# EAGLE design microsd-switch (EAGLE 8.2.0)
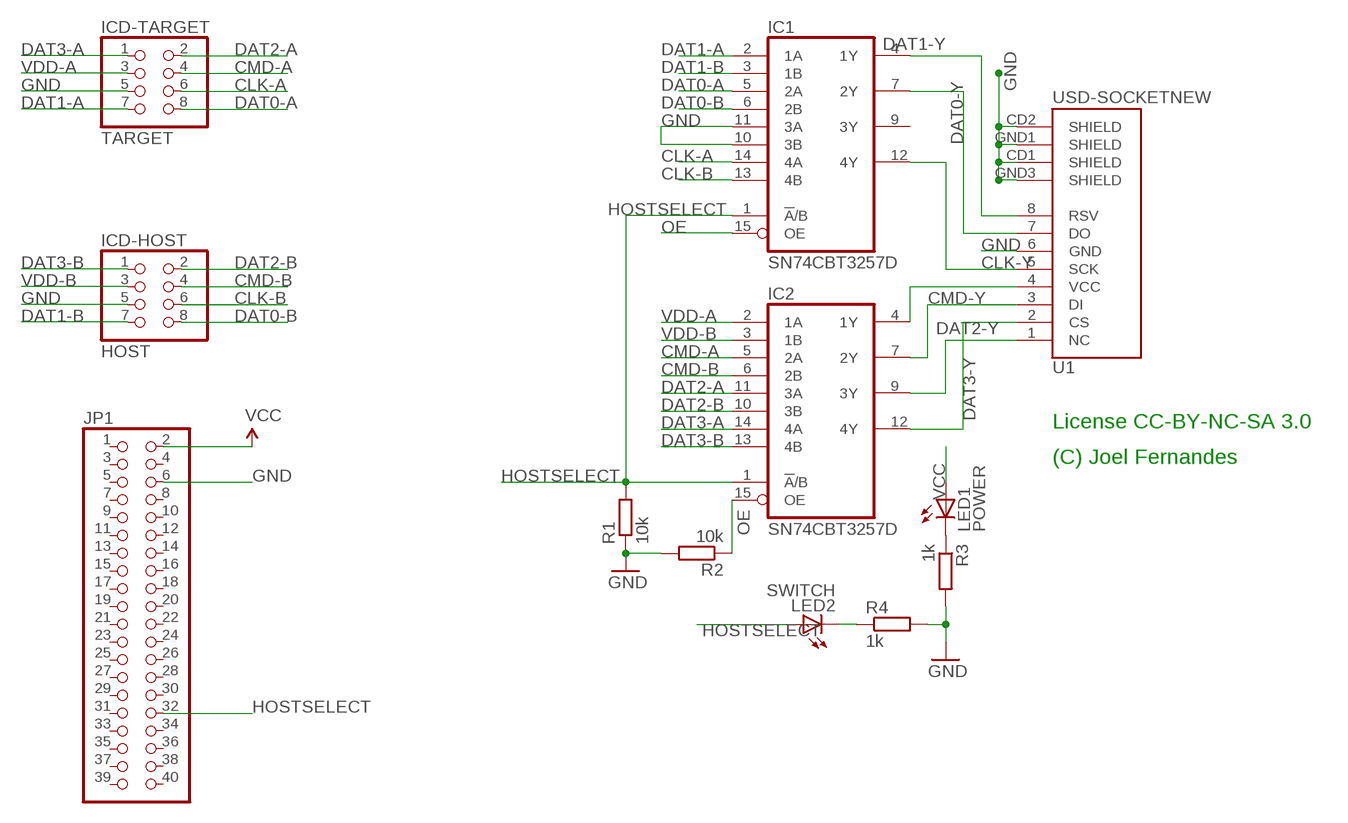
[diagram p0: schematic, sheet 1]

## Parts
IC1  SN74CBT3257D  [SO16]
IC2  SN74CBT3257D  [SO16]
ICD-HOST  HOST  PINHD-2X4  [2X04]
ICD-TARGET  TARGET  PINHD-2X4  [2X04]
JP1  PINHD-2X20  [2X20]
LED1  POWER  LEDCHIP-LED0805  [CHIP-LED0805]
LED2  SWITCH  LEDCHIP-LED0805  [CHIP-LED0805]
R1  10k  R-EU_R1206  [R1206]
R2  10k  R-EU_R1206  [R1206]
R3  1k  R-EU_R1206  [R1206]
R4  1k  R-EU_R1206  [R1206]
U1  USD-SOCKETNEW  [MICRO-SD-SOCKET-PP]

## Nets
CLK-A: IC1.14(4A) ICD-TARGET.6
CLK-B: IC1.13(4B) ICD-HOST.6
CLK-Y: IC1.12(4Y) U1.5(SCK)
CMD-A: IC2.5(2A) ICD-TARGET.4
CMD-B: IC2.6(2B) ICD-HOST.4
CMD-Y: IC2.7(2Y) U1.3(DI)
DAT0-A: IC1.5(2A) ICD-TARGET.8
DAT0-B: IC1.6(2B) ICD-HOST.8
DAT0-Y: IC1.7(2Y) U1.7(DO)
DAT1-A: IC1.2(1A) ICD-TARGET.7
DAT1-B: IC1.3(1B) ICD-HOST.7
DAT1-Y: IC1.4(1Y) U1.8(RSV)
DAT2-A: IC2.11(3A) ICD-TARGET.2
DAT2-B: IC2.10(3B) ICD-HOST.2
DAT2-Y: IC2.9(3Y) U1.1(NC)
DAT3-A: IC2.14(4A) ICD-TARGET.1
DAT3-B: IC2.13(4B) ICD-HOST.1
DAT3-Y: IC2.12(4Y) U1.2(CS)
GND: IC1.10(3B) IC1.11(3A) ICD-HOST.5 ICD-TARGET.5 JP1.6 R1.1 R2.2 R3.2 R4.2 U1.6(GND) U1.CD1(SHIELD) U1.CD2(SHIELD) U1.GND1(SHIELD) U1.GND3(SHIELD)
HOSTSELECT: IC1.1(!A!/B) IC2.1(!A!/B) JP1.32 LED2.A R1.2
N$2: IC2.4(1Y) U1.4(VCC)
N$3: LED1.C R3.1
N$4: LED2.C R4.1
OE: IC1.15(OE) IC2.15(OE) R2.1
VCC: JP1.2 LED1.A
VDD-A: IC2.2(1A) ICD-TARGET.3
VDD-B: IC2.3(1B) ICD-HOST.3
Unconnected: IC1.9(3Y) JP1.1 JP1.3 JP1.4 JP1.5 JP1.7 JP1.8 JP1.9 JP1.10 JP1.11 JP1.12 JP1.13 JP1.14 JP1.15 JP1.16 JP1.17 JP1.18 JP1.19 JP1.20 JP1.21 JP1.22 JP1.23 JP1.24 JP1.25 JP1.26 JP1.27 JP1.28 JP1.29 JP1.30 JP1.31 JP1.33 JP1.34 JP1.35 JP1.36 JP1.37 JP1.38 JP1.39 JP1.40

## Notes on the sheet
- License CC-BY-NC-SA 3.0
- (C) Joel Fernandes

## Power pins joined to a net without a drawn wire
GND: IC1.8(GND) IC2.8(GND)
VCC: IC1.16(VCC) IC2.16(VCC)

## Library data of the parts
IC1 IC2 = joels-parts:SN74CBT3257: High speed Quad 1:2 MUX/DEMUX (4-5.5v vcc, 100mA channel)
ICD-HOST ICD-TARGET = pinhead:PINHD-2X4: PIN HEADER
JP1 = pinhead:PINHD-2X20: PIN HEADER
LED1 LED2 = led:LED: LED OSRAM: - CHIPLED LG R971, LG N971, LY N971, LG Q971, LY Q971, LO R971, LY R971 LH N974, LH R974 LS Q976, LO Q976, LY Q976 LO Q996 - Hyper CHIPLED LW Q18S LB Q993, LB Q99A, LB R99A - SideLED LS A670, LO A670, LY A670, LG A670, LP A670 LB A673, LV A673, LT A673, LW A673 LH A674 LY A675 LS A676, LA A676, LO A676, LY A676, LW A676 LS A679, LY A679, LG A679 - Hyper Micro SIDELED® LS Y876, LA Y876, LO Y876, LY Y876 LT Y87S - SmartLED LW L88C, LW L88S LB L89C, LB L89S, LG L890 LS L89K, LO L89K, LY L89K LS L896, LA L896, LO L896, LY L896 - TOPLED LS T670, LO T670, LY T670, LG T670, LP T670 LSG T670, LSP T670, LSY T670, LOP T670, LYG T670 LG T671, LOG T671, LSG T671 LB T673, LV T673, LT T673, LW T673 LH T674 LS T676, LA T676, LO T676, LY T676, LB T676, LH T676, LSB T676, LW T676 LB T67C, LV T67C, LT T67C, LS T67K, LO T67K, LY T67K, LW E67C LS E67B, LA E67B, LO E67B, LY E67B, LB E67C, LV E67C, LT E67C LW T67C LS T679, LY T679, LG T679 LS T770, LO T770, LY T770, LG T770, LP T770 LB T773, LV T773, LT T773, LW T773 LH T774 LS E675, LA E675, LY E675, LS T675 LS T776, LA T776, LO T776, LY T776, LB T776 LHGB T686 LT T68C, LB T68C - Hyper Mini TOPLED® LB M676 - Mini TOPLED Santana® LG M470 LS M47K, LO M47K, LY M47K Source: http://www.osram.convergy.de LUXEON: - LUMILED® LXK2-PW12-R00, LXK2-PW12-S00, LXK2-PW14-U00, LXK2-PW14-V00 LXK2-PM12-R00, LXK2-PM12-S00, LXK2-PM14-U00 LXK2-PE12-Q00, LXK2-PE12-R00, LXK2-PE12-S00, LXK2-PE14-T00, LXK2-PE14-U00 LXK2-PB12-K00, LXK2-PB12-L00, LXK2-PB12-M00, LXK2-PB14-N00, LXK2-PB14-P00, LXK2-PB14-Q00 LXK2-PR12-L00, LXK2-PR12-M00, LXK2-PR14-Q00, LXK2-PR14-R00 LXK2-PD12-Q00, LXK2-PD12-R00, LXK2-PD12-S00 LXK2-PH12-R00, LXK2-PH12-S00 LXK2-PL12-P00, LXK2-PL12-Q00, LXK2-PL12-R00 Source: www.luxeon.com KINGBRIGHT: KA-3528ASYC Source: www.kingbright.com
R1-R4 = rcl:R-EU_: RESISTOR, European symbol
U1 = SparkFun:USD-SOCKET: microSD Socket Push-push type uSD socket. Schematic element and footprint production proven. Spark Fun Electronics SKU : PRT-00127. tDoc lines correctly indicate media card edge positions when inserting (unlocked, locked, depressed).

## Net classes
0 default: width 0.406 mm, drill 0.254 mm, clearance 0.205 mm
1 power: width 0.406 mm, drill 0.254 mm, clearance 0.205 mm to class 0, clearance 0.205 mm

## Board
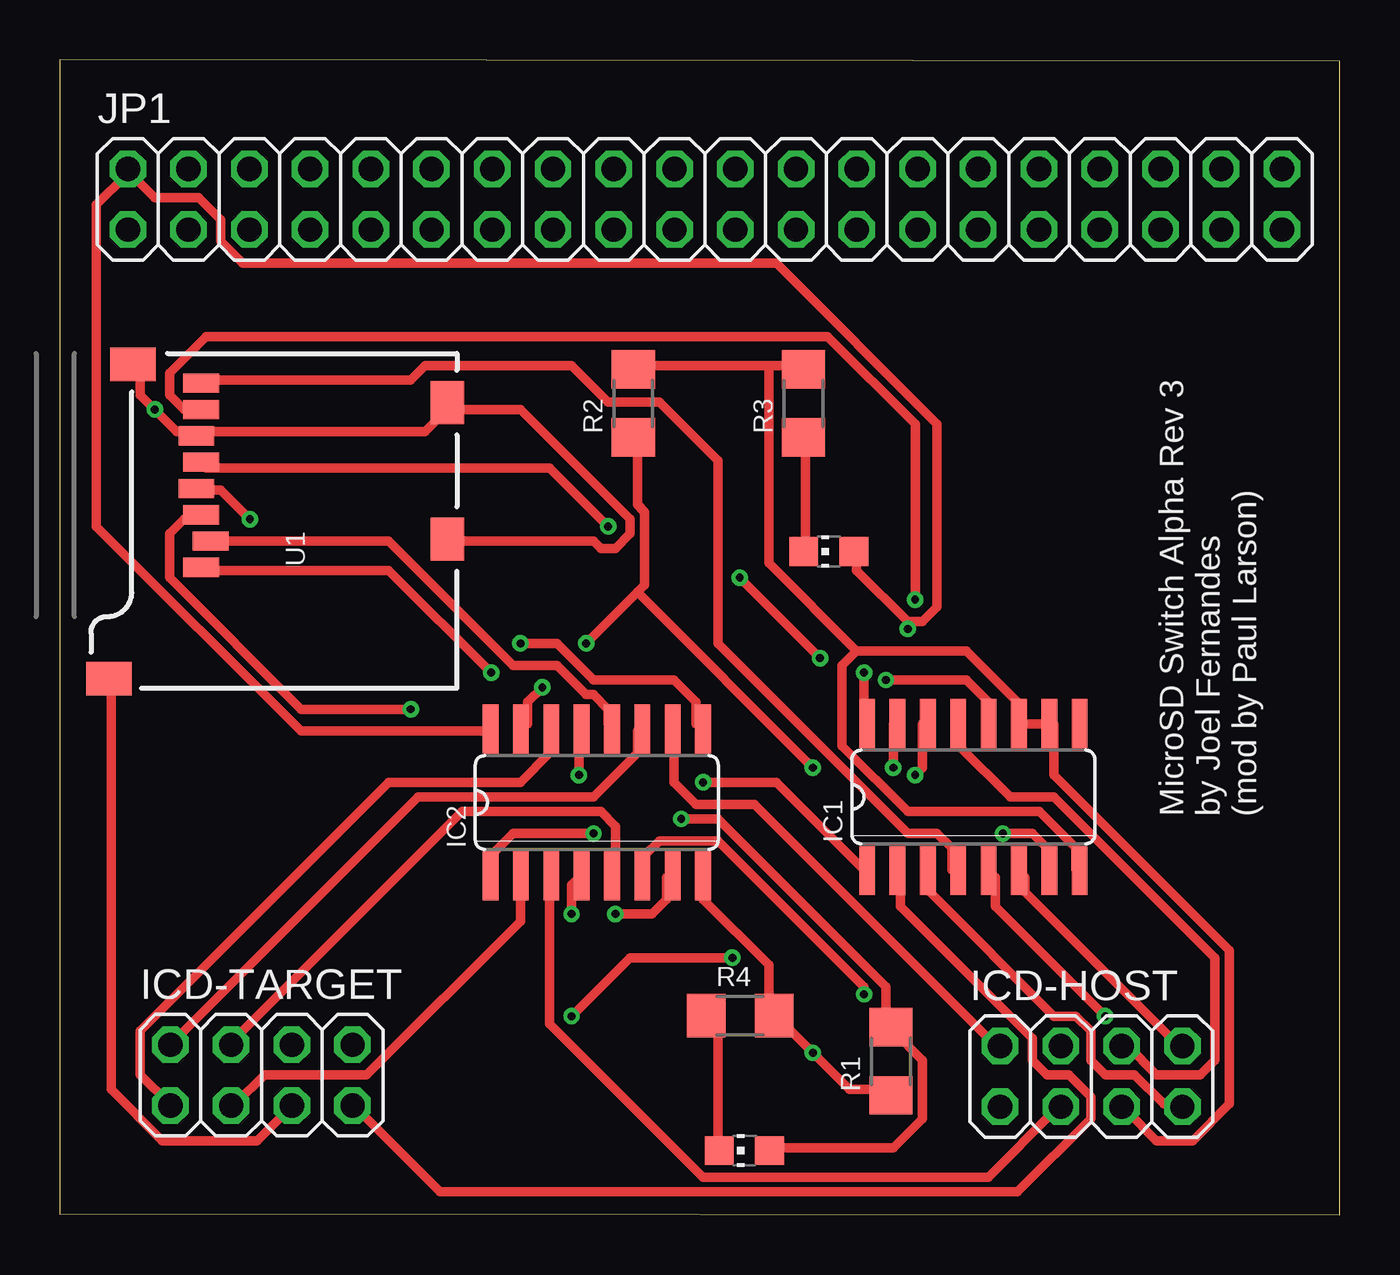
[diagram p1: board, top side]
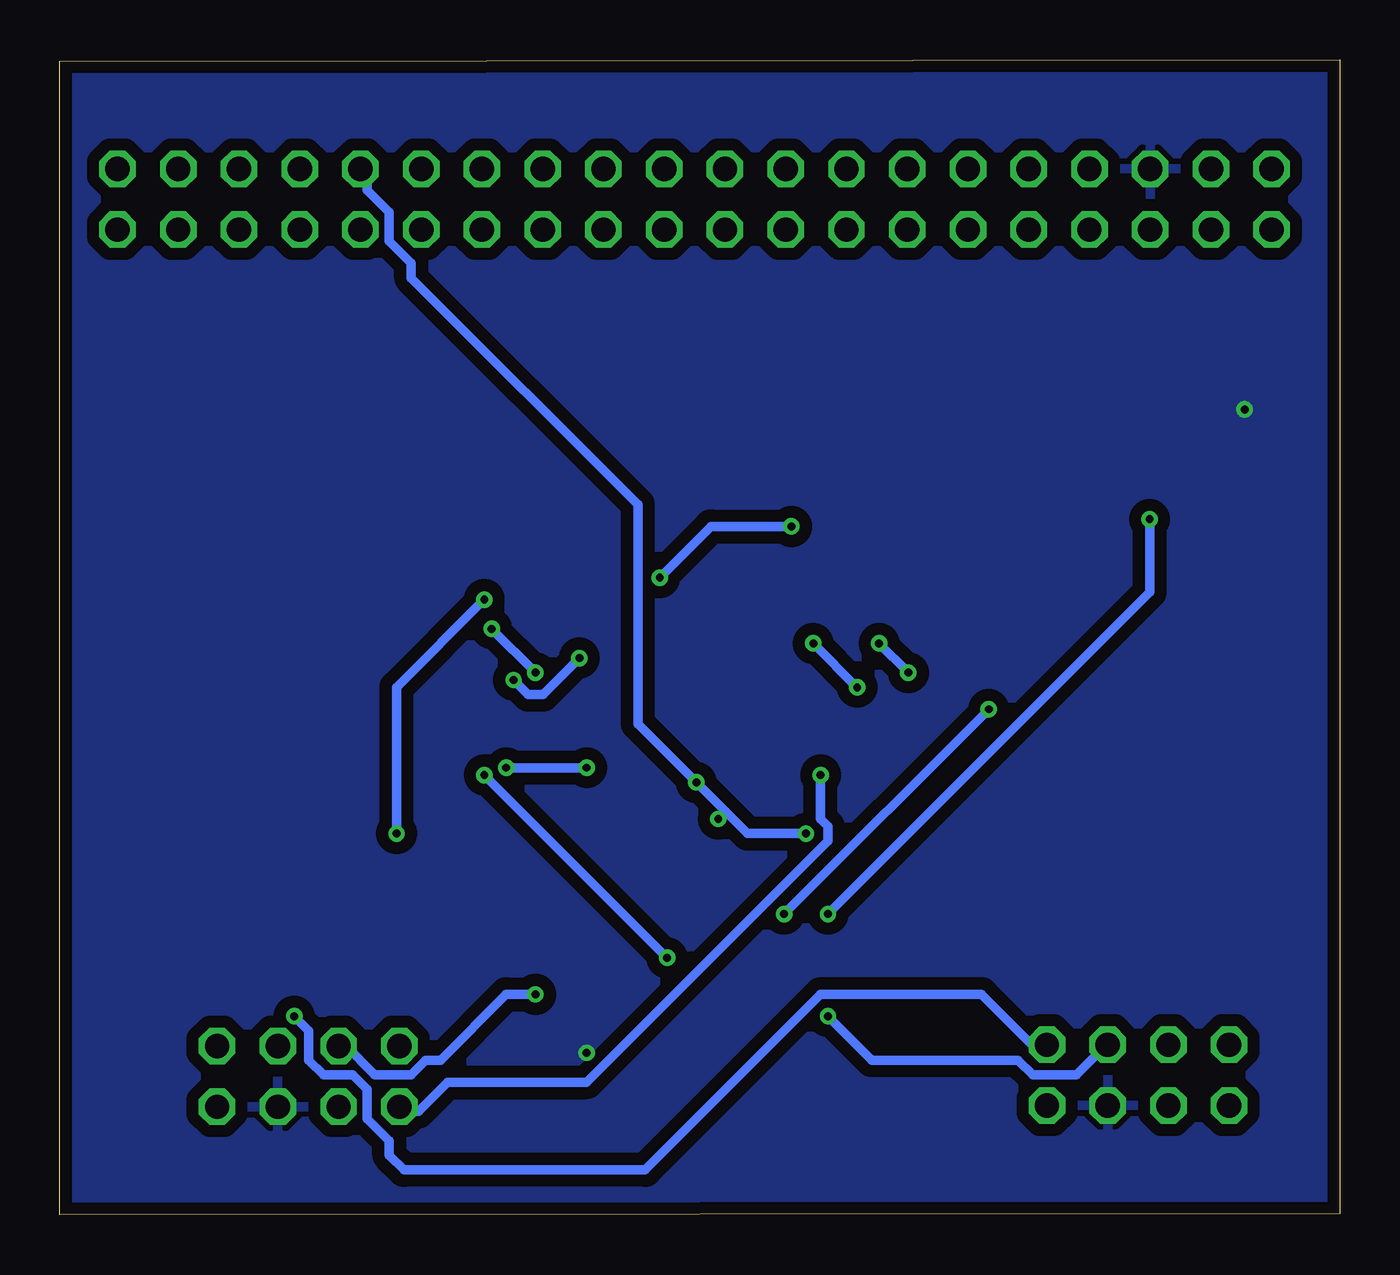
[diagram p2: board, bottom side, seen from below]

Size 53.52 x 48.3 mm. Coordinates in mm from the lower left corner, seen from the top.
Outline: 0,0.05 53.52,0 53.52,48.25 0,48.3 0,0.05
Copper layers (1*16): Top 0.0356mm / dielectric 1.5011mm / Bottom 0.0356mm
Design rules "LaenPCBOrder": minimum track width 6mil, minimum drill 13mil, track to track 6mil, track to pad 6mil, pad to pad 6mil, via to via 6mil, smd to smd 6mil, copper to edge 15mil, drill to drill 6mil, minimum pad ring 7mil, minimum via ring 7mil, stop-mask expansion 3mil, vias tented up to drill 0mil, thermal gap 10mil

### Footprints (pad centres in the part's own frame; a part is rotated, then mirrored left to right if it is on the bottom)
SO16 = smd 0.66 x 2.032: 1 -4.445,-3.073; 2 -3.175,-3.073; 3 -1.905,-3.073; 4 -0.635,-3.073; 5 0.635,-3.073; 6 1.905,-3.073; 7 3.175,-3.073; 8 4.445,-3.073; 9 4.445,3.073; 10 3.175,3.073; 11 1.905,3.073; 12 0.635,3.073; 13 -0.635,3.073; 14 -1.905,3.073; 15 -3.175,3.073; 16 -4.445,3.073
2X04 = drill 1.016 octagon: 1 -3.81,-1.27; 2 -3.81,1.27; 3 -1.27,-1.27; 4 -1.27,1.27; 5 1.27,-1.27; 6 1.27,1.27; 7 3.81,-1.27; 8 3.81,1.27
2X20 = drill 1.016 octagon: 1 -24.13,-1.27; 2 -24.13,1.27; 3 -21.59,-1.27; 4 -21.59,1.27; 5 -19.05,-1.27; 6 -19.05,1.27; 7 -16.51,-1.27; 8 -16.51,1.27; 9 -13.97,-1.27; 10 -13.97,1.27; 11 -11.43,-1.27; 12 -11.43,1.27; 13 -8.89,-1.27; 14 -8.89,1.27; 15 -6.35,-1.27; 16 -6.35,1.27; 17 -3.81,-1.27; 18 -3.81,1.27; 19 -1.27,-1.27; 20 -1.27,1.27; 21 1.27,-1.27; 22 1.27,1.27; 23 3.81,-1.27; 24 3.81,1.27; 25 6.35,-1.27; 26 6.35,1.27; 27 8.89,-1.27; 28 8.89,1.27; 29 11.43,-1.27; 30 11.43,1.27; 31 13.97,-1.27; 32 13.97,1.27; 33 16.51,-1.27; 34 16.51,1.27; 35 19.05,-1.27; 36 19.05,1.27; 37 21.59,-1.27; 38 21.59,1.27; 39 24.13,-1.27; 40 24.13,1.27
CHIP-LED0805 = smd 1.2 x 1.2: A 0,-1.05; C 0,1.05
R1206 = smd 1.6 x 1.803: 1 -1.422,0; 2 1.422,0
MICRO-SD-SOCKET-PP = smd 0.8 x 1.5: 1 -8.94,10.7; 2 -7.84,10.3; 3 -6.74,10.7; 4 -5.64,10.9; 5 -4.54,10.7; 6 -3.44,10.9; 7 -2.34,10.7; 8 -1.24,10.7 | smd 1.8 x 1.4: CD1 -2.05,0.4; CD2 -7.75,0.4 | smd 1.4 x 1.9: GND1 -13.6,14.55; GND3 -0.45,13.55

### Placement (x,y rotation side)
IC1  38.2,17.48 0 top
IC2  22.45,17.25 0 top
ICD-HOST  43.13,5.79 0 top
ICD-TARGET  8.43,5.84 0 top
JP1  26.97,42.47 0 top
LED1  32.16,27.74 90 top
LED2  28.63,2.69 90 top
R1  34.75,6.43 90 top
R2  23.98,33.93 90 top
R3  31.09,33.93 90 top
R4  28.45,8.33 0 top
U1  16.61,36.02 90 top

### Tracks (layer width: path | path; a pad name or v marks a point on that pad's centre or on a via)
CLK-A  (via drill 0.33)
  Top 0.406: v35.77,18.39 36.07,18.7 36.07,20.53 IC1.14 | v28.12,10.75 23.84,10.75 v21.4,8.3
  Bottom 0.406: v28.12,10.75 v35.77,18.39 | v21.4,8.3 19.57,6.47 13.45,6.47 12.84,5.86 11.01,5.86 9.78,7.08 ICD-TARGET.6
CLK-B
  Top 0.406: IC1.13 37.6,20.53 37.6,19.62 39.74,17.48 41.58,17.48 48.3,10.75 48.3,6.47 47.69,5.86 45.85,5.86 44.63,7.08 ICD-HOST.6
CLK-Y  (via drill 0.33)
  Top 0.406: v22.93,28.79 20.48,31.23 6.11,31.23 U1.5 | v31.79,23.28 v28.43,26.65 | v34.54,22.37 37.91,22.37 38.82,21.45 38.82,20.84 IC1.12
  Bottom 0.406: v22.93,28.79 26.29,28.79 v28.43,26.65 | v31.79,23.28 33.32,21.76 33.93,21.76 v34.54,22.37
CMD-A
  Top 0.406: IC2.5 23.23,14.42 23.23,16.25 22.62,16.86 16.81,16.86 7.34,7.39 ICD-TARGET.4
CMD-B  (via drill 0.33)
  Top 0.406: v33.63,9.22 33.63,9.53 27.51,15.64 25.07,15.64 24.46,15.03 24.46,14.42 IC2.6
  Bottom 0.406: v33.63,9.22 34.85,9.22 37.6,6.47 38.21,6.47 38.82,5.86 40.35,5.86 41.58,7.08 ICD-HOST.4
CMD-Y  (via drill 0.33)
  Top 0.406: v14.67,21.14 10.09,21.14 4.58,26.65 4.58,28.48 5.2,29.09 5.81,29.09 U1.3 | v23.23,12.58 24.76,12.58 25.37,13.2 25.37,14.11 IC2.7
  Bottom 0.406: v23.23,12.58 v14.67,21.14
DAT0-A  (via drill 0.33)
  Top 0.406: v43.72,8.3 39.13,12.89 39.13,14.11 IC1.5
  Bottom 0.406: v43.72,8.3 43.1,7.69 43.1,6.47 42.49,5.86 41.27,5.86 40.66,5.25 40.66,4.02 39.74,3.11 39.74,2.5 39.13,1.88 29.04,1.88 21.7,9.22 14.98,9.22 12.53,6.78 12.23,7.08 ICD-TARGET.8
DAT0-B
  Top 0.406: IC1.6 40.35,14.11 40.35,13.5 46.77,7.08 ICD-HOST.8
DAT0-Y  (via drill 0.33)
  Top 0.406: v35.77,25.73 35.77,33.07 32.1,36.73 6.11,36.73 4.58,35.21 4.58,34.29 5.2,33.68 5.81,33.68 U1.7 | v39.44,15.95 40.66,15.95 41.27,15.34 41.27,14.42 IC1.7
  Bottom 0.406: v35.77,25.73 39.44,22.06 v39.44,15.95
DAT1-A
  Top 0.406: IC1.2 35.16,14.11 35.16,12.89 40.66,7.39 40.66,6.47 41.27,5.86 42.19,5.86 43.1,4.94 43.1,4.02 40.05,0.97 15.9,0.97 12.53,4.33 ICD-TARGET.7
DAT1-B
  Top 0.406: IC1.3 36.38,14.11 36.38,13.5 41.58,8.3 42.49,8.3 43.1,7.69 43.1,6.47 43.72,5.86 44.94,5.86 46.16,4.64 46.77,4.64 ICD-HOST.7
DAT1-Y
  Top 0.406: U1.8 6.11,34.9 14.67,34.9 15.29,35.51 21.4,35.51 22.93,33.98 25.07,33.98 27.51,31.54 27.51,23.9 35.46,15.95 36.68,15.95 37.3,15.34 37.3,14.42 IC1.4
DAT2-A
  Top 0.406: IC2.11 24.15,20.23 24.15,19.31 22.32,17.48 14.98,17.48 4.89,7.39 ICD-TARGET.2
DAT2-B
  Top 0.406: IC2.10 25.68,20.23 25.68,18.09 26.6,17.17 29.04,17.17 39.13,7.08 ICD-HOST.2
DAT2-Y  (via drill 0.33)
  Top 0.406: v18.04,22.67 13.76,26.95 6.11,26.95 U1.1 | v19.26,23.9 20.79,23.9 22.32,22.37 25.68,22.37 26.6,21.45 26.6,20.53 IC2.9
  Bottom 0.406: v19.26,23.9 v18.04,22.67
DAT3-A
  Top 0.406: IC2.14 20.48,20.23 20.48,19.31 19.26,18.09 13.76,18.09 3.36,7.69 3.36,5.86 4.58,4.64 ICD-TARGET.1
DAT3-B  (via drill 0.33)
  Top 0.406: v21.7,18.39 21.7,20.23 IC2.13
  Bottom 0.406: v21.7,18.39 21.7,16.56 21.4,16.25 21.4,15.64 31.49,5.55 37.3,5.55 38.52,4.33 39.13,4.33 ICD-HOST.1
DAT3-Y
  Top 0.406: U1.2 6.42,28.17 13.76,28.17 18.95,22.98 20.79,22.98 22.01,21.76 22.32,21.76 22.93,21.14 22.93,20.53 IC2.12
GND  (via drill 0.33)
  Top 0.406: 29.65,35.51 30.88,35.51 R3.2 | 29.65,35.51 24.15,35.51 R2.2 | 33.32,23.59 32.71,22.98 32.71,19.62 35.46,16.86 40.96,16.86 42.49,15.34 42.49,14.42 IC1.8 | 33.32,23.59 37.91,23.59 40.05,21.45 40.05,20.84 IC1.11 40.35,20.53 41.27,20.53 IC1.10 41.58,20.53 41.58,18.39 48.91,11.06 48.91,4.64 47.38,3.11 45.85,3.11 44.63,4.33 ICD-HOST.5 | 29.65,35.51 29.65,27.26 33.32,23.59 | U1.GND3 3.36,35.51 3.36,34.29 v3.97,33.68 4.89,32.76 5.5,32.76 U1.6 5.81,32.76 15.29,32.76 16.2,33.68 U1.CD1 16.51,33.68 19.26,33.68 23.84,29.09 23.84,28.48 23.23,27.87 22.62,27.87 22.32,28.17 16.51,28.17 U1.CD2 | R1.1 34.54,5.25 33.02,5.25 v31.49,6.78 29.96,8.3 R4.2 29.65,8.61 29.65,10.44 26.9,13.2 26.9,14.11 IC2.8 | U1.GND1 2.14,22.37 2.14,5.25 4.28,3.11 8.25,3.11 9.48,4.33 ICD-TARGET.5
  pour Bottom (isolate 0.508): 0.71,47.8 52.98,47.8 52.98,0.66 0.61,0.66 0.61,47.75
HOSTSELECT  (via drill 0.33)
  Top 0.406: LED2.A 29.96,2.8 34.85,2.8 36.07,4.02 36.07,6.47 34.85,7.69 R1.2 34.54,8 34.54,9.53 27.51,16.56 v25.98,16.56 | v22.32,15.95 18.95,15.95 18.04,15.03 18.04,14.42 IC2.1 | v26.9,18.09 29.96,18.09 33.63,14.42 IC1.1
  Bottom 0.406: v22.32,15.95 24.76,15.95 25.68,16.86 | 25.68,16.86 v26.9,18.09 29.35,20.53 29.35,29.7 38.82,39.18 38.82,39.79 39.74,40.71 39.74,41.93 40.66,42.85 40.66,43.46 JP1.32 | 25.68,16.86 v25.98,16.56
N$2  (via drill 0.33)
  Top 0.406: v7.95,29.09 6.72,30.31 5.81,30.31 U1.4 | v21.4,12.58 21.4,13.81 21.7,14.11 IC2.4
  Bottom 0.406: v7.95,29.09 7.95,26.04 v21.4,12.58
N$3
  Top 0.406: LED1.C 31.18,27.87 31.18,32.45 R3.1
N$4
  Top 0.406: LED2.C 27.51,2.8 27.51,8 27.21,8.3 R4.1
OE  (via drill 0.33)
  Top 0.406: v22.01,23.9 24.15,26.04 | 24.15,26.04 24.46,26.34 24.46,29.4 24.15,29.7 24.15,32.45 R2.1 | v20.18,22.06 19.57,21.45 19.57,20.53 IC2.15 | v34.85,18.7 34.85,20.53 IC1.15 | 24.15,26.04 v31.49,18.7
  Bottom 0.406: v20.18,22.06 v22.01,23.9 | v31.49,18.7 v34.85,18.7
VCC  (via drill 0.33)
  Top 0.406: 35.46,24.81 33.32,26.95 33.32,27.56 LED1.A | 35.46,24.81 36.07,24.81 36.68,25.42 36.68,33.07 29.96,39.79 7.64,39.79 6.72,40.71 6.72,41.63 5.81,42.54 3.97,42.54 3.06,43.46 JP1.2 2.75,43.46 1.53,42.24 1.53,28.79 10.09,20.23 17.73,20.23 IC2.16 | v33.63,22.67 33.63,20.84 IC1.16 | 35.46,24.81 v35.46,24.51
  Bottom 0.406: v35.46,24.51 v33.63,22.67
VDD-A
  Top 0.406: IC2.2 19.26,14.11 19.26,12.28 12.84,5.86 8.56,5.86 7.34,4.64 ICD-TARGET.3
VDD-B
  Top 0.406: IC2.3 20.48,14.11 20.48,8 26.9,1.58 38.82,1.58 41.58,4.33 ICD-HOST.3

### Text on the board
tNames: MicroSD Switch Alpha Rev 3 / by Joel Fernandes / (mod by Paul Larson)